# EAGLE design ARD_1_0 (EAGLE 8.3.2)
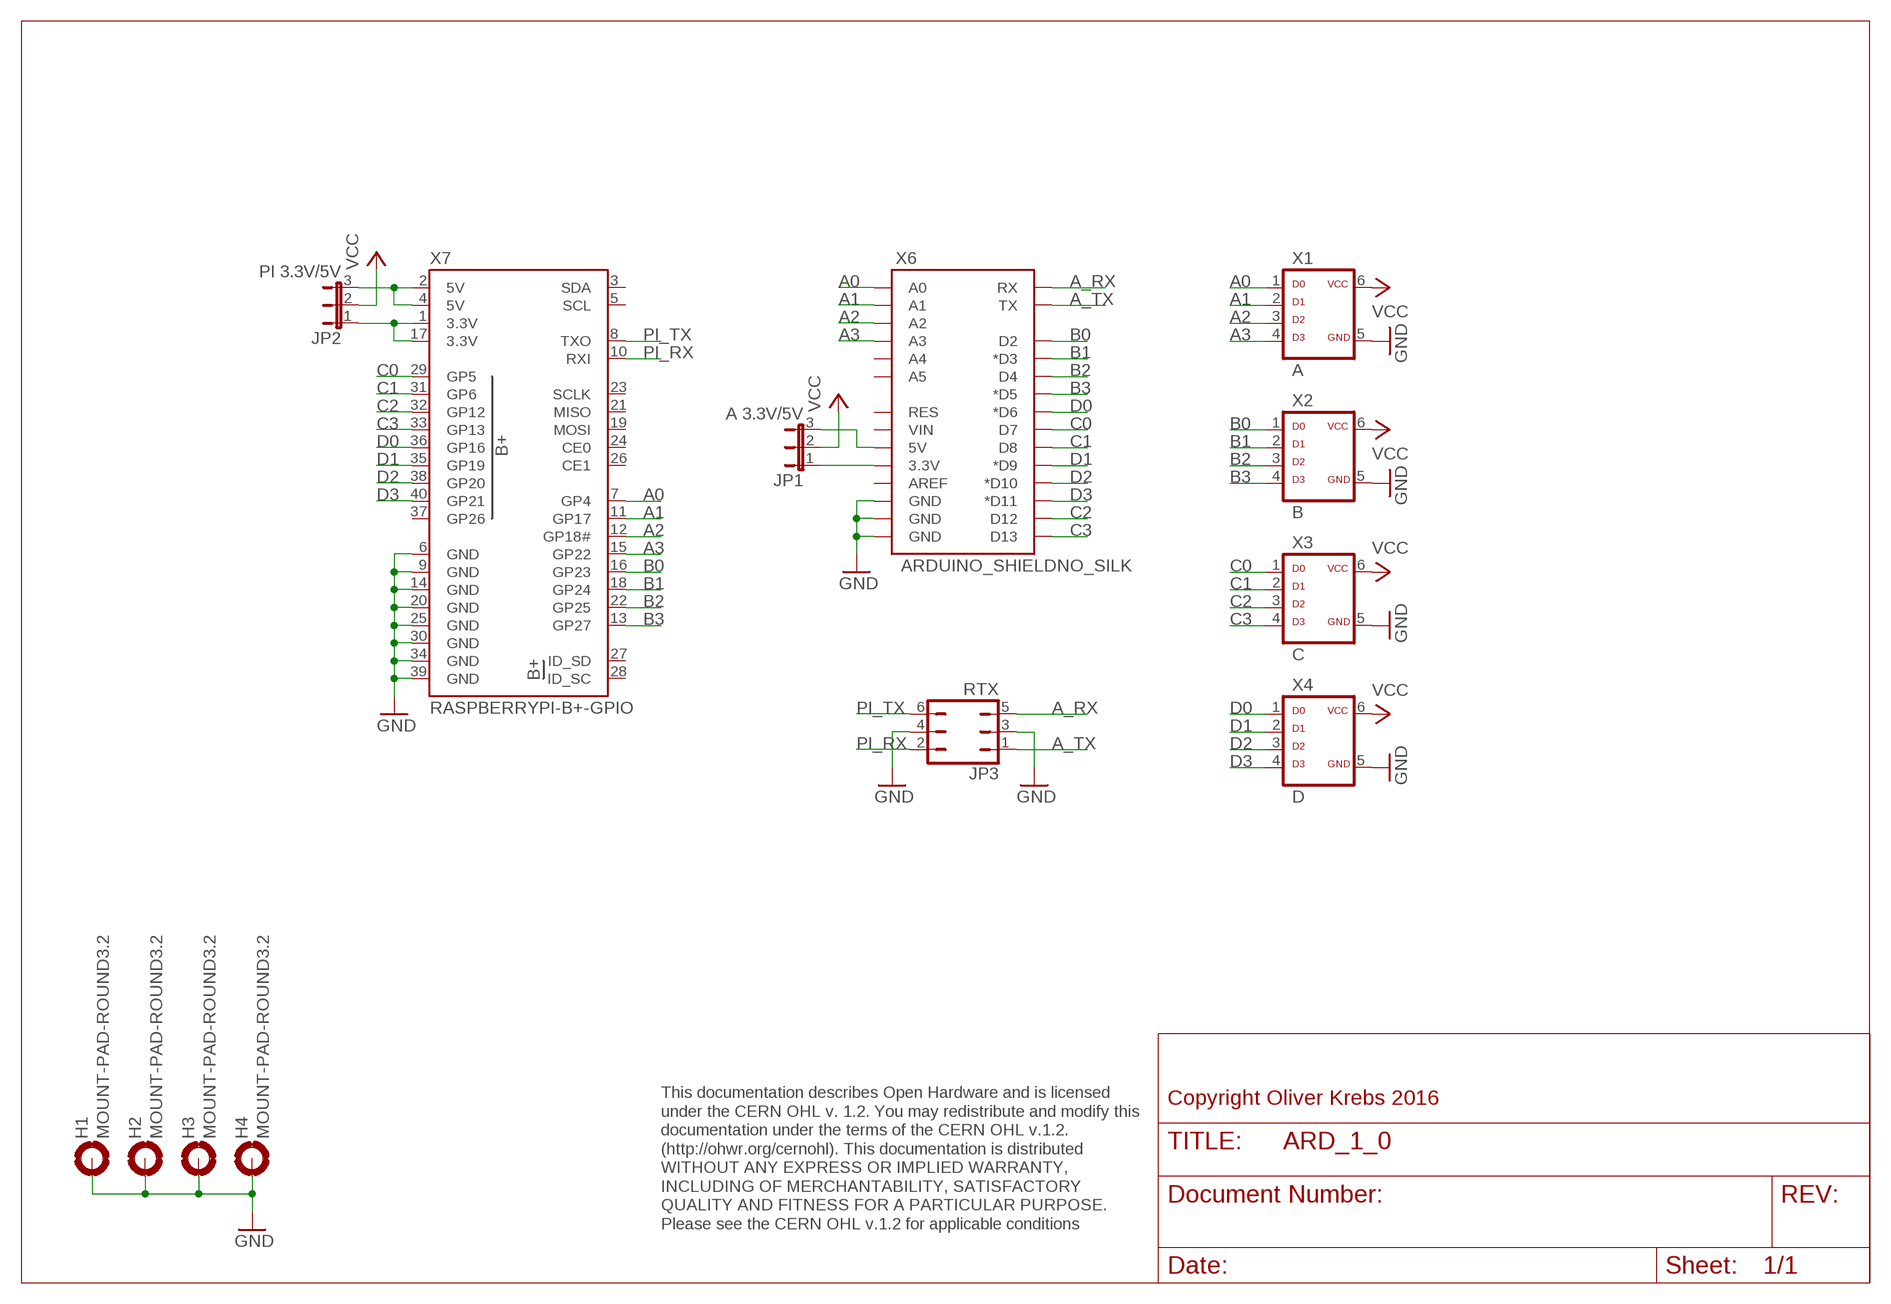
[diagram p0: schematic, sheet 1]

## Parts
H1  MOUNT-PAD-ROUND3.2  [3,2-PAD]
H2  MOUNT-PAD-ROUND3.2  [3,2-PAD]
H3  MOUNT-PAD-ROUND3.2  [3,2-PAD]
H4  MOUNT-PAD-ROUND3.2  [3,2-PAD]
JP1  A 3.3V/5V  JP2E  [JP2]
JP2  PI 3.3V/5V  JP2E  [JP2]
JP3  RTX  JP3Q  [JP3Q]
X1  A  ML6D  [ML-6]
X2  B  ML6D  [ML-6]
X3  C  ML6D  [ML-6]
X4  D  ML6D  [ML-6]
X6  ARDUINO_SHIELDNO_SILK  [DUEMILANOVE_VIAS]
X7  RASPBERRYPI-B+-GPIO  [2X20-SHROUDED]

## Nets
A0: X1.1 X6.A0 X7.7(GP4)
A1: X1.2 X6.A1 X7.11(GP17)
A2: X1.3 X6.A2 X7.12(GP18#)
A3: X1.4 X6.A3 X7.15(GP22)
A_RX: JP3.5 X6.RX
A_TX: JP3.1 X6.TX
B0: X2.1 X6.D2 X7.16(GP23)
B1: X2.2 X6.D3(*D3) X7.18(GP24)
B2: X2.3 X6.D4 X7.22(GP25)
B3: X2.4 X6.D5(*D5) X7.13(GP27)
C0: X3.1 X6.D7 X7.29(GP5)
C1: X3.2 X6.D8 X7.31(GP6)
C2: X3.3 X6.D12 X7.32(GP12)
C3: X3.4 X6.D13 X7.33(GP13)
D0: X4.1 X6.D6(*D6) X7.36(GP16)
D1: X4.2 X6.D9(*D9) X7.35(GP19)
D2: X4.3 X6.D10(*D10) X7.38(GP20)
D3: X4.4 X6.D11(*D11) X7.40(GP21)
GND: H1.B3,2(MOUNT) H2.B3,2(MOUNT) H3.B3,2(MOUNT) H4.B3,2(MOUNT) JP3.3 JP3.4 X1.5 X2.5 X3.5 X4.5 X6.GND@0(GND) X6.GND@1(GND) X6.GND@2(GND) X7.6(GND) X7.9(GND) X7.14(GND) X7.20(GND) X7.25(GND) X7.30(GND) X7.34(GND) X7.39(GND)
N$1: JP2.3 X7.2(5V) X7.4(5V)
N$2: JP2.1 X7.1(3.3V) X7.17(3.3V)
N$20: JP1.1 X6.3.3V
N$21: JP1.3 X6.5V
PI_RX: JP3.2 X7.10(RXI)
PI_TX: JP3.6 X7.8(TXO)
VCC: JP1.2 JP2.2 X1.6 X2.6 X3.6 X4.6
Unconnected: X6.A4 X6.A5 X6.AREF X6.RES X6.VIN X7.3(SDA) X7.5(SCL) X7.19(MOSI) X7.21(MISO) X7.23(SCLK) X7.24(CE0) X7.26(CE1) X7.27(ID_SD) X7.28(ID_SC) X7.37(GP26)

## Notes on the sheet
- Copyright Oliver Krebs 2016
- This documentation describes Open Hardware and is licensed 
  under the CERN OHL v. 1.2. You may redistribute and modify this 
  documentation under the terms of the CERN OHL v.1.2. 
  (http://ohwr.org/cernohl). This documentation is distributed
  WITHOUT ANY EXPRESS OR IMPLIED WARRANTY, 
  INCLUDING OF MERCHANTABILITY, SATISFACTORY 
  QUALITY AND FITNESS FOR A PARTICULAR PURPOSE. 
  Please see the CERN OHL v.1.2 for applicable conditions

## Library data of the parts
H1-H4 = holes:MOUNT-PAD-ROUND: MOUNTING PAD, round
JP1 JP2 = jumper:JP2E: JUMPER
JP3 = 01-my-con:JP3Q
X1-X4 = 01-my-con:ML6D
X6 = SparkFun-Boards:ARDUINO_SHIELD: Arduino shield footprint
X7 = SparkFun-Boards:RASPBERRYPI-B+-GPIO: Raspberry Pi B+ GPIO Header 2x20 pin connector

## Board
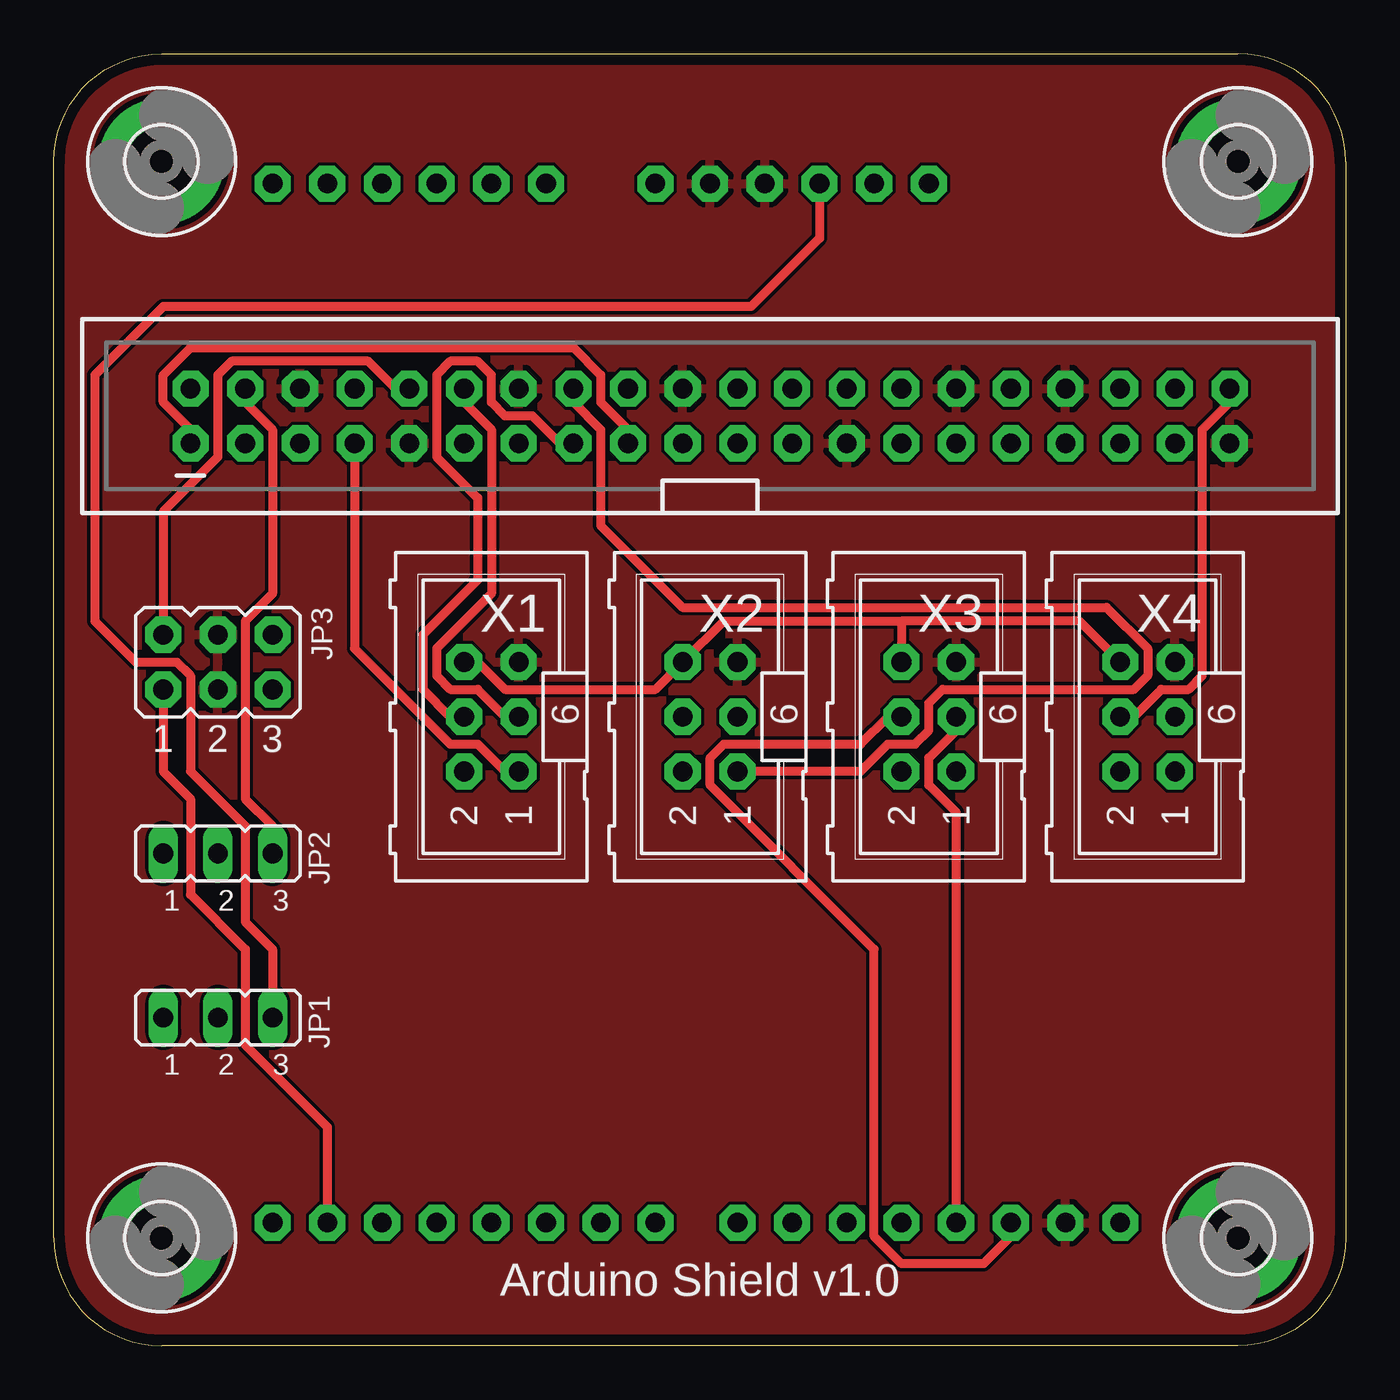
[diagram p1: board, top side]
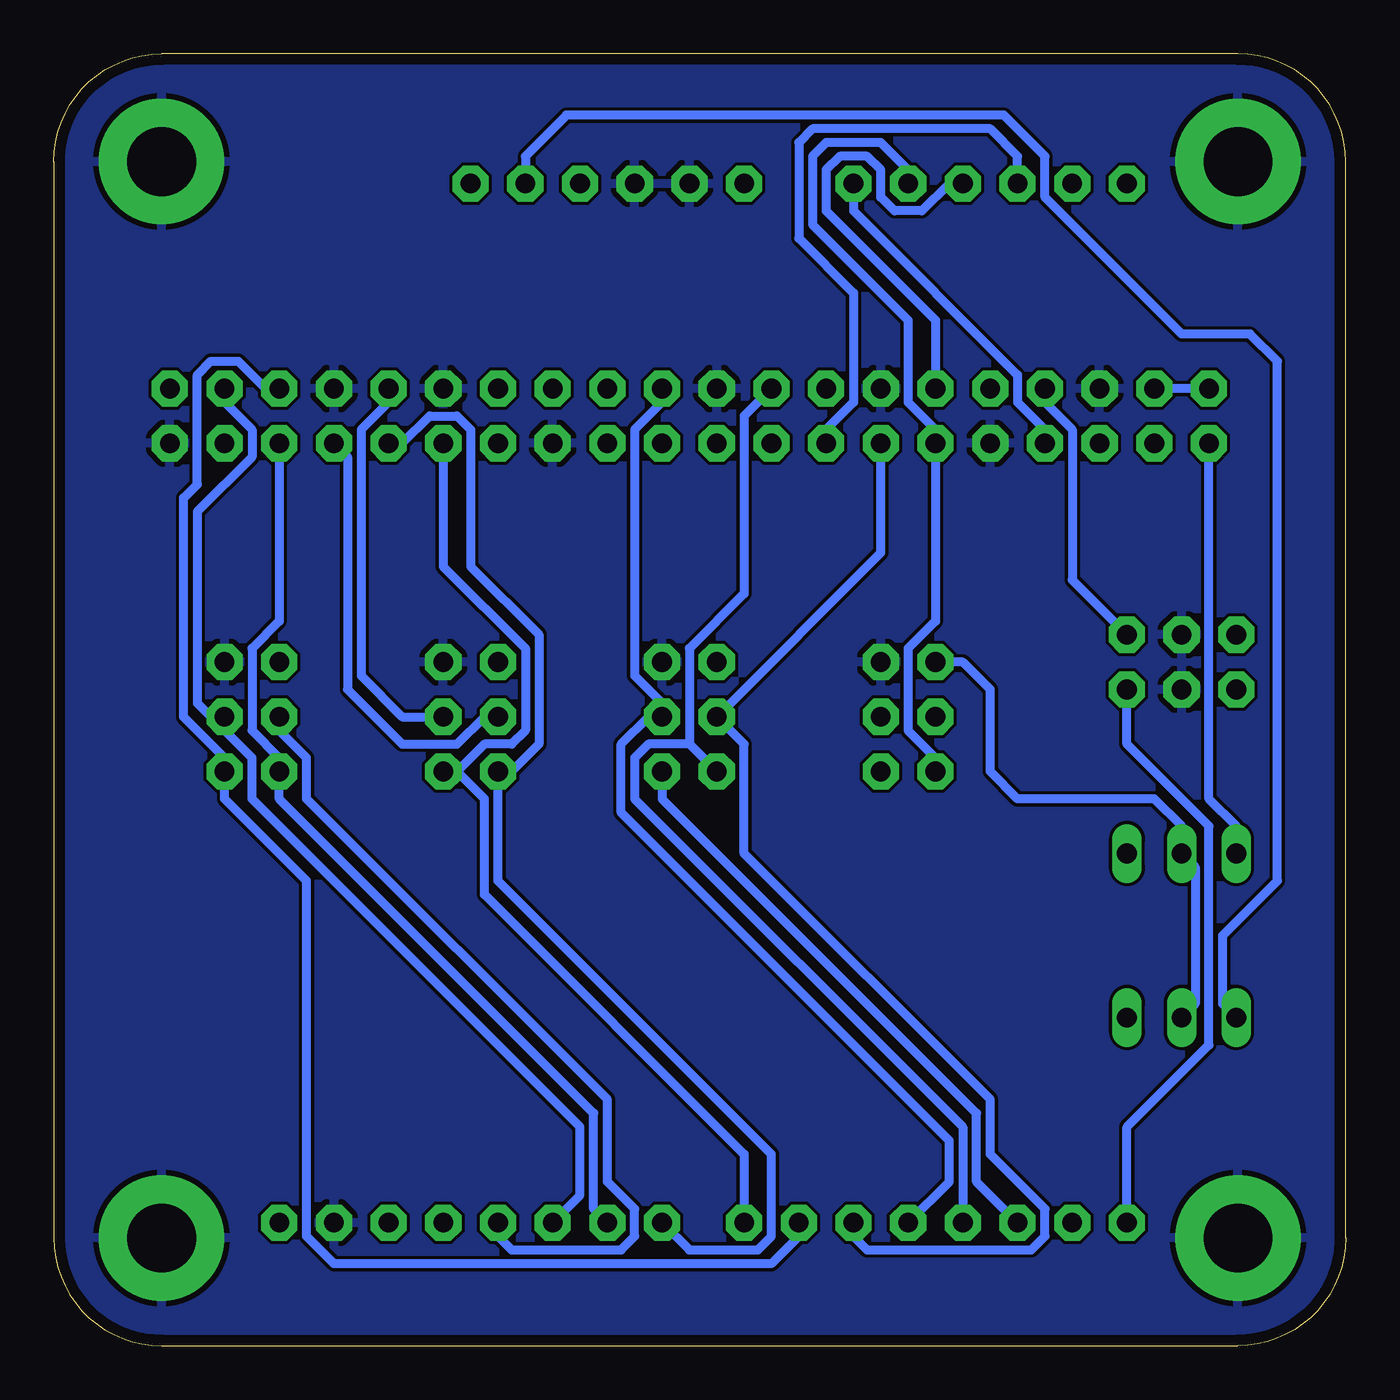
[diagram p2: board, bottom side, seen from below]

Size 60 x 60 mm. Coordinates in mm from the lower left corner, seen from the top.
Outline: 0,5 0,55 arc-90 5,60 55,60 arc-90 60,55 60,5 arc-90 55,0 5,0 arc-90 0,5
Copper layers (1*16): Top 0.035mm / dielectric 1.6mm / Bottom 0.035mm
Design rules "Elecrow_2-layer_PCB_eagle_rule": minimum track width 6mil, minimum drill 12mil, track to track 6mil, track to pad 6mil, pad to pad 6mil, via to via 8mil, smd to smd 0mil, copper to edge 20mil, drill to drill 10mil, minimum pad ring 6mil, minimum via ring 6mil, stop-mask expansion 0mil, vias tented up to drill 100mil, thermal gap 10mil

### Footprints (pad centres in the part's own frame; a part is rotated, then mirrored left to right if it is on the bottom)
3,2-PAD = drill 3.2 pad 5.842: B3,2 0,0
JP2 = drill 0.914 long: 1 -2.54,0; 2 0,0; 3 2.54,0
JP3Q = drill 0.914 pad 1.676 octagon: 1 -2.54,-1.27; 2 -2.54,1.27; 3 0,-1.27; 4 0,1.27; 5 2.54,-1.27; 6 2.54,1.27
ML-6 = drill 0.914 pad 1.676 octagon: 1 -2.54,-1.27; 2 -2.54,1.27; 3 0,-1.27; 4 0,1.27; 5 2.54,-1.27; 6 2.54,1.27
DUEMILANOVE_VIAS = drill 0.914 pad 1.676 octagon: 3.3V 50.8,13.97; 5V 50.8,16.51; A0 50.8,29.21; A1 50.8,31.75; A2 50.8,34.29; A3 50.8,36.83; A4 50.8,39.37; A5 50.8,41.91; AREF 2.54,2.54; D2 2.54,36.83; D3 2.54,34.29; D4 2.54,31.75; D5 2.54,29.21; D6 2.54,26.67; D7 2.54,24.13; D8 2.54,20.32; D9 2.54,17.78; D10 2.54,15.24; D11 2.54,12.7; D12 2.54,10.16; D13 2.54,7.62; GND@0 50.8,19.05; GND@1 50.8,21.59; GND@2 2.54,5.08; RES 50.8,11.43; RX 2.54,41.91; TX 2.54,39.37; VIN 50.8,24.13
2X20-SHROUDED = drill 0.914 pad 1.676 octagon: 1 -1.27,24.13; 2 1.27,24.13; 3 -1.27,21.59; 4 1.27,21.59; 5 -1.27,19.05; 6 1.27,19.05; 7 -1.27,16.51; 8 1.27,16.51; 9 -1.27,13.97; 10 1.27,13.97; 11 -1.27,11.43; 12 1.27,11.43; 13 -1.27,8.89; 14 1.27,8.89; 15 -1.27,6.35; 16 1.27,6.35; 17 -1.27,3.81; 18 1.27,3.81; 19 -1.27,1.27; 20 1.27,1.27; 21 -1.27,-1.27; 22 1.27,-1.27; 23 -1.27,-3.81; 24 1.27,-3.81; 25 -1.27,-6.35; 26 1.27,-6.35; 27 -1.27,-8.89; 28 1.27,-8.89; 29 -1.27,-11.43; 30 1.27,-11.43; 31 -1.27,-13.97; 32 1.27,-13.97; 33 -1.27,-16.51; 34 1.27,-16.51; 35 -1.27,-19.05; 36 1.27,-19.05; 37 -1.27,-21.59; 38 1.27,-21.59; 39 -1.27,-24.13; 40 1.27,-24.13

### Placement (x,y rotation side)
H1  5,5 0 top
H2  55,5 0 top
H3  55,55 0 top
H4  5,55 0 top
JP1  7.62,15.24 0 top
JP2  7.62,22.86 0 top
JP3  7.62,31.75 0 top
X1  20.32,29.21 90 top
X2  30.48,29.21 90 top
X3  40.64,29.21 90 top
X4  50.8,29.21 90 top
X6  52.07,3.17 90 top
X7  30.48,43.18 90 top

### Tracks (layer width: path | path; a pad name or v marks a point on that pad's centre or on a via)
A0
  Top 0.406: X7.7 13.97,32.38 18.41,27.94 19.68,27.94 20.95,26.67 X1.1
  Bottom 0.406: X6.A0 22.86,52.7 15.24,45.09 15.24,43.81 13.97,42.55 X7.7
A1
  Bottom 0.406: X6.A1 20.32,54.61 21.59,55.88 24.13,55.88 24.77,55.24 24.77,52.07 20.32,47.62 20.32,43.81 19.05,42.55 X7.11 19.05,33.66 20.32,32.38 20.32,28.57 19.05,27.3 X1.2
A2
  Top 0.406: X7.12 19.05,43.81 20.32,42.55 20.32,34.92 17.78,32.38 17.78,31.11 18.41,30.48 19.68,30.48 20.95,29.21 X1.3
  Bottom 0.406: X6.A2 18.41,53.98 19.68,52.7 20.95,52.7 21.59,53.34 21.59,54.61 22.23,55.24 23.5,55.24 24.13,54.61 24.13,52.7 19.05,47.62 X7.12
A3
  Top 0.406: X7.15 23.5,41.91 22.23,43.18 20.95,43.18 20.32,43.81 20.32,45.09 19.68,45.72 18.41,45.72 17.78,45.09 17.78,41.27 19.68,39.37 19.68,35.56 17.14,33.02 17.14,30.48 18.41,29.21 X1.4
  Bottom 0.406: X6.A3 15.24,55.24 16.51,56.52 24.77,56.52 25.4,55.88 25.4,51.44 22.86,48.9 22.86,43.81 24.13,42.55 X7.15
A_RX
  Bottom 0.406: X6.RX 10.16,10.16 6.35,13.97 6.35,24.13 10.16,27.94 JP3.5
A_TX
  Top 0.406: JP3.1 5.08,26.67 6.35,25.4 6.35,20.95 8.89,18.41 8.89,13.97 12.7,10.16 X6.TX
B0
  Top 0.406: X7.16 24.13,43.81 25.4,42.55 25.4,38.1 29.21,34.29 48.9,34.29 50.8,32.38 50.8,31.11 50.16,30.48 41.27,30.48 40.64,29.84 40.64,28.57 40.01,27.94 38.73,27.94 37.47,26.67 X2.1
  Bottom 0.406: X2.1 31.75,25.4 17.14,10.79 17.14,7.62 X6.D2
B1
  Bottom 0.406: X2.2 30.48,27.94 | 30.48,27.94 32.38,27.94 33.02,27.3 33.02,25.4 17.78,10.16 X6.D3 | X7.18 27.94,43.18 27.94,34.92 30.48,32.38 30.48,27.94
B2
  Bottom 0.406: X7.22 31.75,43.81 33.02,42.55 33.02,31.11 31.75,29.84 X2.3 32.38,29.21 33.66,27.94 33.66,24.77 18.41,9.53 18.41,7.62 X6.D4
B3
  Bottom 0.406: X7.13 21.59,36.83 X2.4 27.94,27.94 27.94,22.86 16.51,11.43 16.51,8.89 13.97,6.35 13.97,5.08 14.61,4.45 22.23,4.45 22.86,5.08 X6.D5
C0
  Bottom 0.406: X6.D7 27.94,8.89 40.01,20.95 40.01,25.4 41.27,26.67 | X7.29 41.91,36.2 38.1,32.38 38.1,28.57 38.73,27.94 40.01,27.94 41.27,26.67 | 41.27,26.67 X3.1
C1
  Bottom 0.406: X7.31 43.81,41.91 42.55,43.18 41.27,43.18 40.64,42.55 40.64,36.2 37.47,33.02 37.47,27.94 38.73,26.67 X3.2 39.37,21.59 26.67,8.89 26.67,5.08 27.3,4.45 30.48,4.45 X6.D8
C2
  Top 0.406: X6.D12 41.91,24.77 40.64,26.04 40.64,27.3 41.91,28.57 X3.3
  Bottom 0.406: X7.32 44.45,43.81 45.72,42.55 45.72,31.11 43.81,29.21 X3.3
C3
  Top 0.406: X6.D13 44.45,5.08 43.18,3.81 39.37,3.81 38.1,5.08 38.1,18.41 30.48,26.04 30.48,27.3 31.11,27.94 37.47,27.94 38.73,29.21 X3.4
  Bottom 0.406: X3.4 40.01,29.21 41.27,27.94 43.81,27.94 46.35,30.48 46.35,41.27 X7.33
D0
  Bottom 0.406: X7.36 50.16,44.45 51.44,45.72 52.7,45.72 53.34,45.09 53.34,40.01 53.98,39.37 53.98,29.21 52.07,27.3 X4.1 52.07,25.4 48.26,21.59 48.26,5.08 46.99,3.81 26.67,3.81 25.4,5.08 X6.D6
D1
  Bottom 0.406: X7.35 49.53,33.66 50.8,32.38 50.8,28.57 49.53,27.3 X4.2 49.53,25.4 34.92,10.79 34.92,6.35 X6.D9
D2
  Bottom 0.406: X7.38 52.07,43.81 50.8,42.55 50.8,41.27 53.34,38.73 53.34,29.84 52.07,28.57 | 52.07,28.57 50.8,27.3 50.8,25.4 35.56,10.16 35.56,6.99 X6.D10 | 52.07,28.57 X4.3
D3
  Top 0.406: X4.4 50.16,29.21 51.44,30.48 52.7,30.48 53.34,31.11 53.34,42.55 54.61,43.81 X7.40
  Bottom 0.406: X6.D11 39.37,5.08 38.73,4.45 33.66,4.45 33.02,5.08 33.02,6.35 34.29,7.62 34.29,11.43 48.26,25.4 48.26,27.3 49.53,28.57 X4.4
GND
  pour Bottom: 0,60.96 60.96,60.96 60.96,0 0,0
  pour Top: 0,60.96 60.96,60.96 60.96,0 0,0
N$1
  Top 0.406: X7.4 8.89,43.81 10.16,42.55 10.16,34.92 8.89,33.66 8.89,25.4 10.16,24.13 JP2.3
  Bottom 0.406: X7.2 X7.4
N$2
  Top 0.406: X7.1 6.35,42.55 5.08,43.81 5.08,45.09 6.35,46.35 24.13,46.35 25.4,45.09 25.4,43.81 26.67,42.55 X7.17
  Bottom 0.406: JP2.1 5.08,24.13 6.35,25.4 X7.1
N$20
  Bottom 0.406: X6.3.3V 38.1,55.24 36.2,57.15 15.88,57.15 13.97,55.24 13.97,53.34 7.62,46.99 4.45,46.99 3.17,45.72 3.17,21.59 5.71,19.05 5.71,15.88 JP1.1
N$21
  Top 0.406: X6.5V 35.56,51.44 32.38,48.26 5.08,48.26 1.91,45.09 1.91,33.66 3.81,31.75 5.71,31.75 6.35,31.11 6.35,26.67 8.89,24.13 8.89,19.68 10.16,18.41 JP1.3
PI_RX
  Top 0.406: X7.10 15.88,44.45 14.61,45.72 8.26,45.72 7.62,45.09 7.62,41.27 5.08,38.73 JP3.2
PI_TX
  Bottom 0.406: X7.8 13.97,43.81 12.7,42.55 12.7,35.56 JP3.6
VCC
  Top 0.406: X4.6 47.62,33.66 39.37,33.66 | 39.37,33.66 X3.6 | 39.37,33.66 31.11,33.66 X2.6 27.94,30.48 20.95,30.48 19.68,31.75 X1.6
  Bottom 0.406: X1.6 17.78,31.75 16.51,30.48 16.51,26.67 15.24,25.4 8.89,25.4 7.62,24.13 JP2.2 6.99,22.23 6.99,15.88 JP1.2

### Text on the board
tNames: Arduino Shield v1.0
200bmp: E:/Bilder/Elektronik/Modulion/Mexdulon/mexdulon_50x50_pcb.bmp | E:/Bilder/Elektronik/Modulion/Mexdulon/mexdulon_50x50_pcb.bmp